# Altium schematic sheet sensors.SchDoc
size A
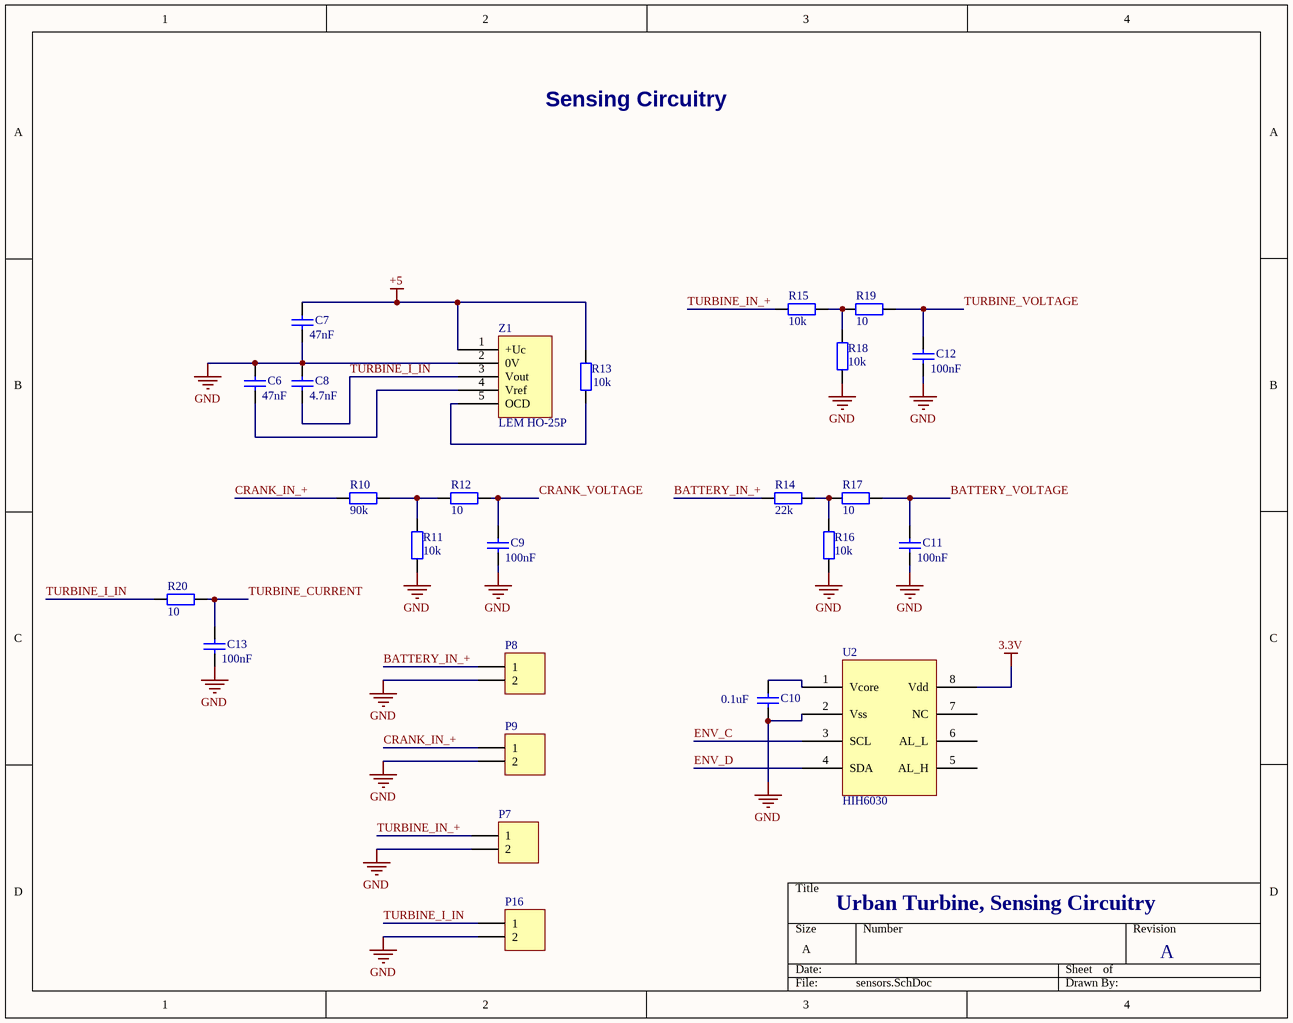
[diagram p0: sensors.SchDoc]

## Parts
C6  value 47nF  [RAD-0.1]  (hidden comment: Cap)
C7  value 47nF  [RAD-0.1]  (hidden comment: Cap)
C8  value 4.7nF  [RAD-0.1]  (hidden comment: Cap)
C9  value 100nF  [RAD-0.1]  (hidden comment: Cap)
C10  value 0.1uF  [RAD-0.1]  (hidden comment: p)
C11  value 100nF  [RAD-0.1]  (hidden comment: Cap)
C12  value 100nF  [RAD-0.1]  (hidden comment: Cap)
C13  value 100nF  [RAD-0.1]  (hidden comment: Cap)
P7  (no value)  [HDR1X2]
P8  (no value)  [HDR1X2]
P9  (no value)  [HDR1X2]
P16  (no value)  [HDR1X2]
R10  value 90k  [AXIAL-0.4]  (hidden comment: Res2)
R11  value 10k  [AXIAL-0.4]  (hidden comment: Res2)
R12  value 10  [AXIAL-0.4]  (hidden comment: Res2)
R13  value 10k  [AXIAL-0.4]  (hidden comment: Res2)
R14  value 22k  [AXIAL-0.4]  (hidden comment: Res2)
R15  value 10k  [AXIAL-0.4]  (hidden comment: Res2)
R16  value 10k  [AXIAL-0.4]  (hidden comment: Res2)
R17  value 10  [AXIAL-0.4]  (hidden comment: Res2)
R18  value 10k  [AXIAL-0.4]  (hidden comment: Res2)
R19  value 10  [AXIAL-0.4]  (hidden comment: Res2)
R20  value 10  [AXIAL-0.4]  (hidden comment: Res2)
U2  HIH6030  [HIH6300]
Z1  LEM HO-25P  [HO-25]

## Nets
3.3V: U2.8(Vdd)
+5: C7.2 R13.2 Z1.1(+Uc)
GND: C6.2 C7.1 C8.2 C9.1 C10.1 C11.1 C12.1 C13.1 P7.2 P8.2 P9.2 P16.2 R11.2 R16.2 R18.2 U2.2(Vss) Z1.2(0V)
BATTERY_IN_+: P8.1 R14.2
BATTERY_VOLTAGE: C11.2 R17.1
CRANK_IN_+: P9.1 R10.2
CRANK_VOLTAGE: C9.2 R12.1
ENV_C: U2.3(SCL)
ENV_D: U2.4(SDA)
TURBINE_CURRENT: C13.2 R20.1
TURBINE_I_IN: C8.1 P16.1 R20.2 Z1.3(Vout)
TURBINE_IN_+: P7.1 R15.2
TURBINE_VOLTAGE: C12.2 R19.1
NetC6_1: C6.1 Z1.4(Vref)
NetC10_2: C10.2 U2.1(Vcore)
NetR10_1: R10.1 R11.1 R12.2
NetR13_1: R13.1 Z1.5(OCD)
NetR14_1: R14.1 R16.1 R17.2
NetR15_1: R15.1 R18.1 R19.2

Not connected (* = marked no-connect by the designer): U2 5(AL_H) 6(AL_L) 7(NC)

## Notes on the sheet
- Sensing Circuitry
- Urban Turbine, Sensing Circuitry
- A

## Library data of the parts
C6-C13 = Cap: Capacitor; Published: 8-Jun-2000; LatestRevisionDate: 17-Jul-2002; LatestRevisionNote: Re-released for DXP Platform.; PackageReference: RAD-0.3; Publisher: Altium Limited; PackageDescription: Radial Cap, Thru-Hole; 2 Leads; 0.3 in Pin Spacing
P7-P9 P16 = Header 2: Header, 2-Pin; LatestRevisionDate: 17-Jul-2002; LatestRevisionNote: Re-released for DXP Platform.; Publisher: Altium Limited
R10-R20 = Res2: Resistor; Published: 8-Jun-2000; LatestRevisionDate: 17-Jul-2002; LatestRevisionNote: Re-released for DXP Platform.; PackageReference: AXIAL-0.4; Publisher: Altium Limited; PackageDescription: Axial Device, Thru-Hole; 2 Leads; 0.4 in Pin Spacing
U2 = HIH6030: Temp/Humidity Sensor
Z1 = LEM HO-25P: Hall Effect Current Sensor